# EAGLE design COBreplacement (EAGLE 9.2.2)
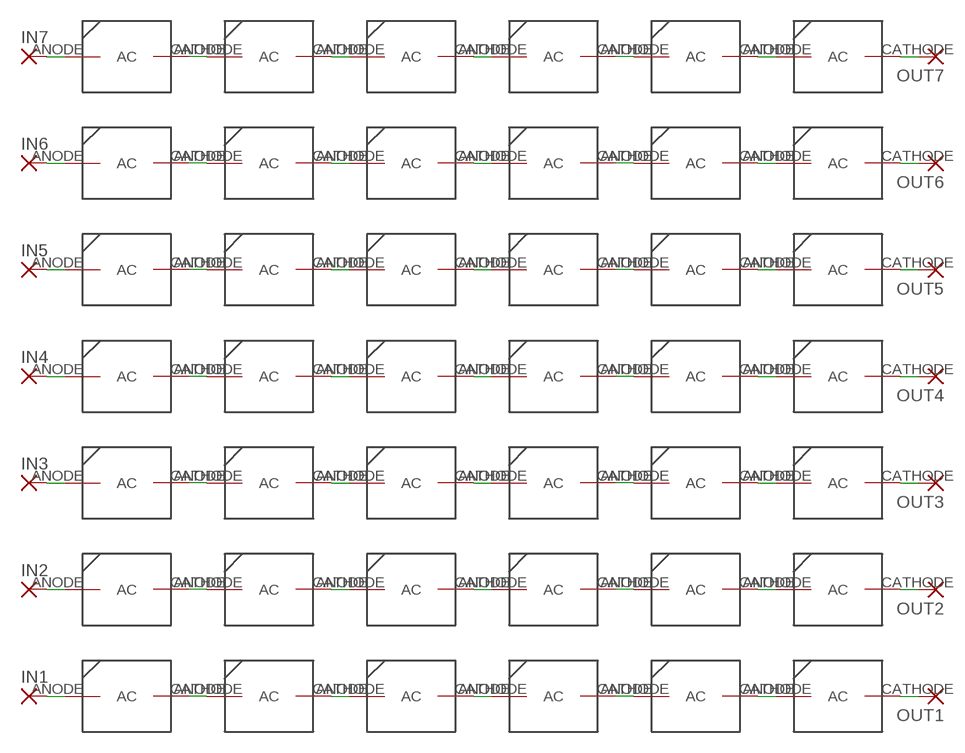
[diagram p0: schematic, sheet 1]

## Parts
IN1  SMD2  [SMD1,27-2,54]
IN2  SMD2  [SMD1,27-2,54]
IN3  SMD2  [SMD1,27-2,54]
IN4  SMD2  [SMD1,27-2,54]
IN5  SMD2  [SMD1,27-2,54]
IN6  SMD2  [SMD1,27-2,54]
IN7  SMD2  [SMD1,27-2,54]
OUT1  SMD2  [SMD1,27-2,54]
OUT2  SMD2  [SMD1,27-2,54]
OUT3  SMD2  [SMD1,27-2,54]
OUT4  SMD2  [SMD1,27-2,54]
OUT5  SMD2  [SMD1,27-2,54]
OUT6  SMD2  [SMD1,27-2,54]
OUT7  SMD2  [SMD1,27-2,54]
U$1  XPE35LED  [XPE35]
U$2  XPE35LED  [XPE35]
U$3  XPE35LED  [XPE35]
U$4  XPE35LED  [XPE35]
U$5  XPE35LED  [XPE35]
U$6  XPE35LED  [XPE35]
U$7  XPE35LED  [XPE35]
U$8  XPE35LED  [XPE35]
U$9  XPE35LED  [XPE35]
U$10  XPE35LED  [XPE35]
U$11  XPE35LED  [XPE35]
U$12  XPE35LED  [XPE35]
U$13  XPE35LED  [XPE35]
U$14  XPE35LED  [XPE35]
U$15  XPE35LED  [XPE35]
U$16  XPE35LED  [XPE35]
U$17  XPE35LED  [XPE35]
U$18  XPE35LED  [XPE35]
U$19  XPE35LED  [XPE35]
U$20  XPE35LED  [XPE35]
U$21  XPE35LED  [XPE35]
U$22  XPE35LED  [XPE35]
U$23  XPE35LED  [XPE35]
U$24  XPE35LED  [XPE35]
U$25  XPE35LED  [XPE35]
U$26  XPE35LED  [XPE35]
U$27  XPE35LED  [XPE35]
U$28  XPE35LED  [XPE35]
U$29  XPE35LED  [XPE35]
U$30  XPE35LED  [XPE35]
U$31  XPE35LED  [XPE35]
U$32  XPE35LED  [XPE35]
U$33  XPE35LED  [XPE35]
U$34  XPE35LED  [XPE35]
U$35  XPE35LED  [XPE35]
U$36  XPE35LED  [XPE35]
U$37  XPE35LED  [XPE35]
U$38  XPE35LED  [XPE35]
U$39  XPE35LED  [XPE35]
U$40  XPE35LED  [XPE35]
U$41  XPE35LED  [XPE35]
U$42  XPE35LED  [XPE35]

## Nets
N$1: U$1.CATHODE(C) U$2.ANODE(A)
N$2: U$2.CATHODE(C) U$3.ANODE(A)
N$3: U$3.CATHODE(C) U$4.ANODE(A)
N$4: U$4.CATHODE(C) U$5.ANODE(A)
N$5: U$5.CATHODE(C) U$6.ANODE(A)
N$6: IN6.1(P) U$1.ANODE(A)
N$7: OUT6.1(P) U$6.CATHODE(C)
N$8: U$7.CATHODE(C) U$8.ANODE(A)
N$9: U$8.CATHODE(C) U$9.ANODE(A)
N$10: U$9.CATHODE(C) U$10.ANODE(A)
N$11: U$10.CATHODE(C) U$11.ANODE(A)
N$12: U$11.CATHODE(C) U$12.ANODE(A)
N$13: IN5.1(P) U$7.ANODE(A)
N$14: OUT5.1(P) U$12.CATHODE(C)
N$15: U$13.CATHODE(C) U$14.ANODE(A)
N$16: U$14.CATHODE(C) U$15.ANODE(A)
N$17: U$15.CATHODE(C) U$16.ANODE(A)
N$18: U$16.CATHODE(C) U$17.ANODE(A)
N$19: U$17.CATHODE(C) U$18.ANODE(A)
N$20: IN4.1(P) U$13.ANODE(A)
N$21: OUT4.1(P) U$18.CATHODE(C)
N$22: U$19.CATHODE(C) U$20.ANODE(A)
N$23: U$20.CATHODE(C) U$21.ANODE(A)
N$24: U$21.CATHODE(C) U$22.ANODE(A)
N$25: U$22.CATHODE(C) U$23.ANODE(A)
N$26: U$23.CATHODE(C) U$24.ANODE(A)
N$27: IN3.1(P) U$19.ANODE(A)
N$28: OUT3.1(P) U$24.CATHODE(C)
N$29: U$25.CATHODE(C) U$26.ANODE(A)
N$30: U$26.CATHODE(C) U$27.ANODE(A)
N$31: U$27.CATHODE(C) U$28.ANODE(A)
N$32: U$28.CATHODE(C) U$29.ANODE(A)
N$33: U$29.CATHODE(C) U$30.ANODE(A)
N$34: IN2.1(P) U$25.ANODE(A)
N$35: OUT2.1(P) U$30.CATHODE(C)
N$36: U$31.CATHODE(C) U$32.ANODE(A)
N$37: U$32.CATHODE(C) U$33.ANODE(A)
N$38: U$33.CATHODE(C) U$34.ANODE(A)
N$39: U$34.CATHODE(C) U$35.ANODE(A)
N$40: U$35.CATHODE(C) U$36.ANODE(A)
N$41: IN1.1(P) U$31.ANODE(A)
N$42: OUT1.1(P) U$36.CATHODE(C)
N$43: U$37.CATHODE(C) U$38.ANODE(A)
N$44: U$38.CATHODE(C) U$39.ANODE(A)
N$45: U$39.CATHODE(C) U$40.ANODE(A)
N$46: U$40.CATHODE(C) U$41.ANODE(A)
N$47: U$41.CATHODE(C) U$42.ANODE(A)
N$48: IN7.1(P) U$37.ANODE(A)
N$49: OUT7.1(P) U$42.CATHODE(C)

## Library data of the parts
IN1-IN7 OUT1-OUT7 = wirepad:SMD2: SMD PAD
U$1-U$42 = XPE35LED:XPE35LED

## Board
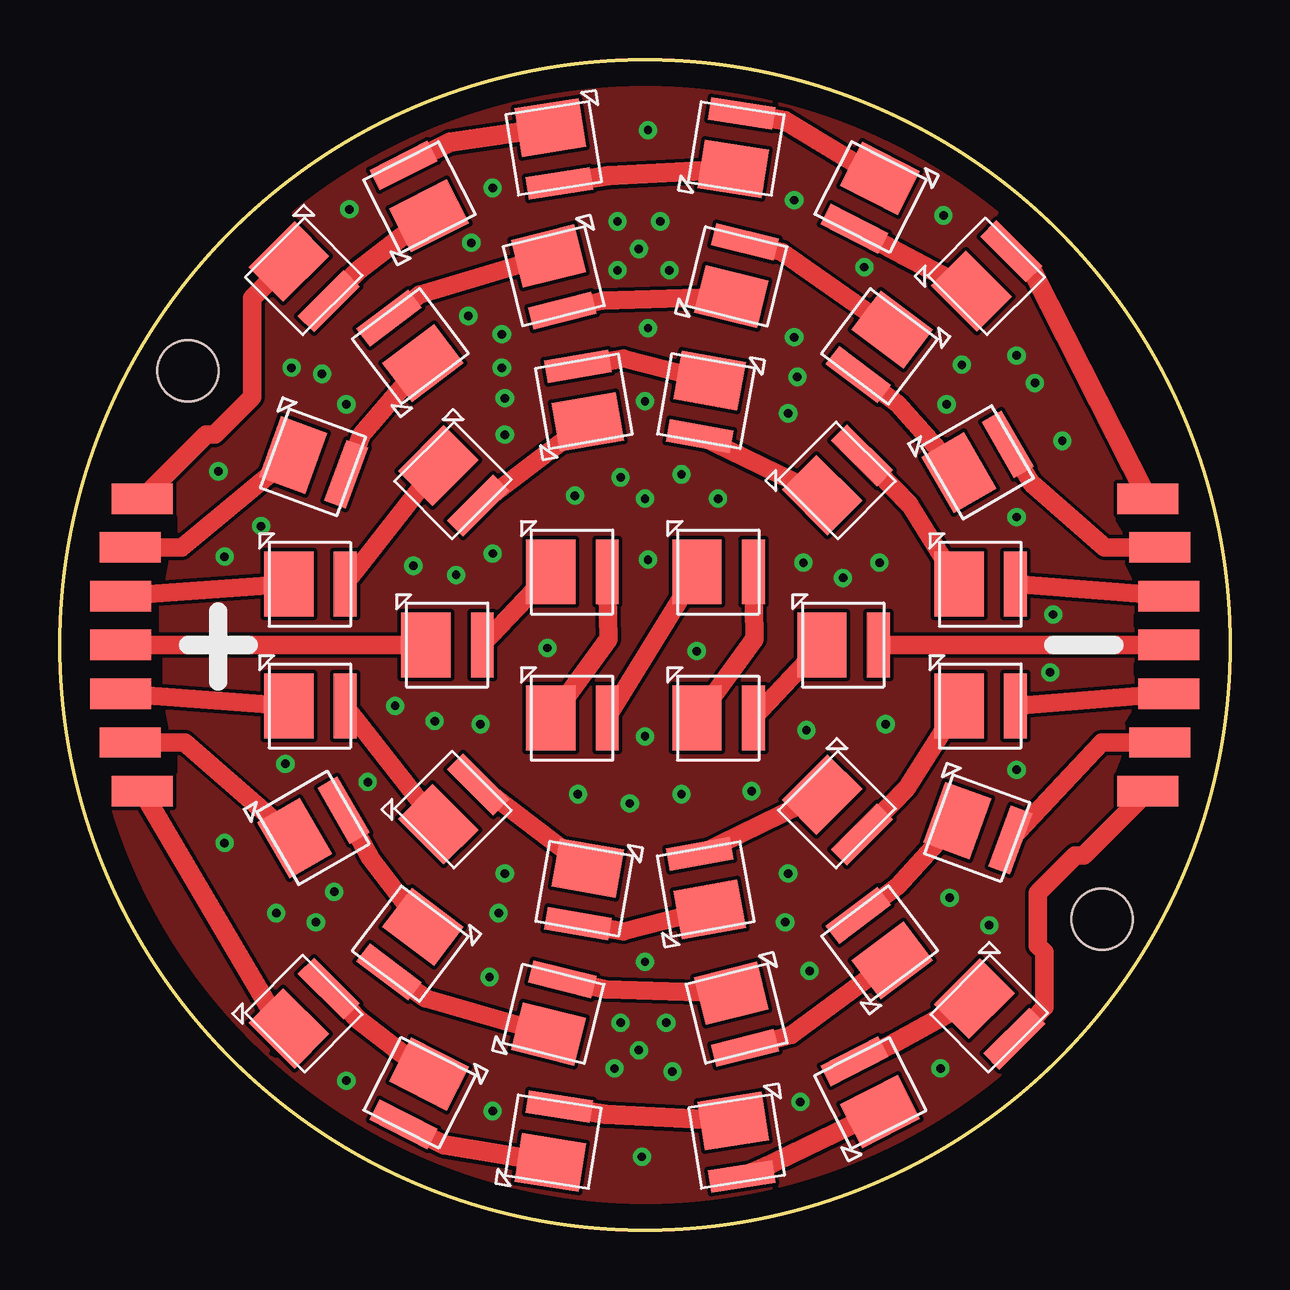
[diagram p1: board, top side]
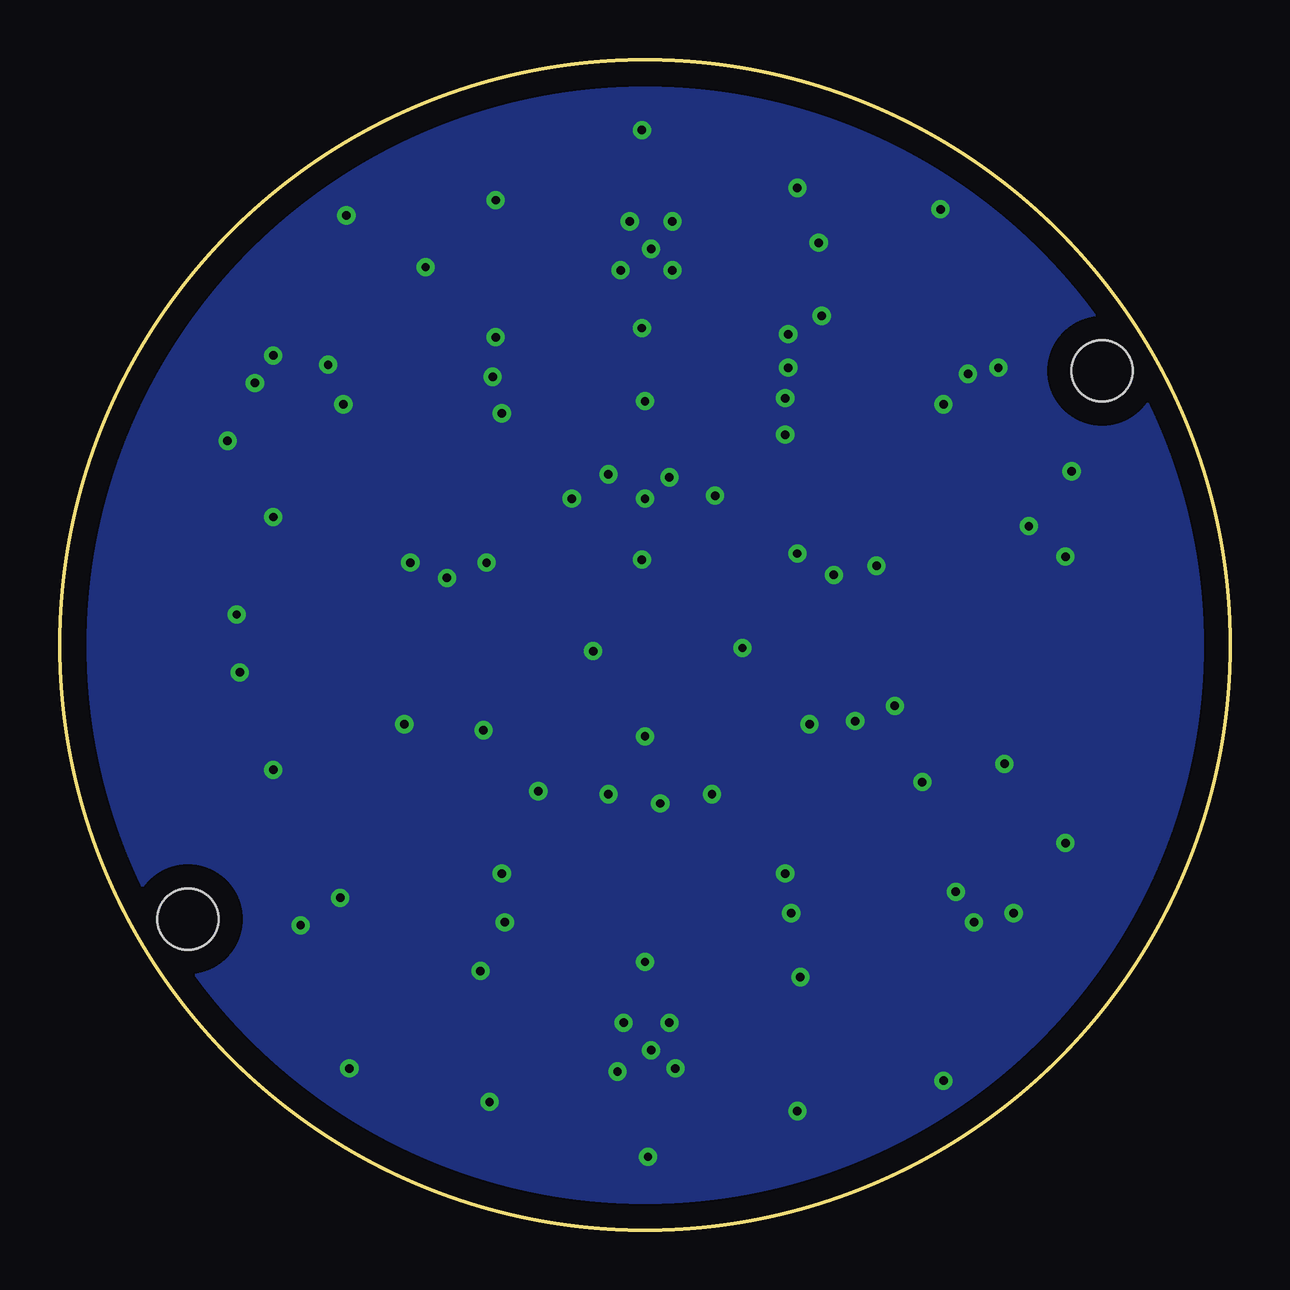
[diagram p2: board, bottom side, seen from below]

Size 48.77 x 48.77 mm. Coordinates in mm from the lower left corner, seen from the top.
Outline: circle at 24.38,24.38 radius 24.38
Copper layers (1*16): Top 0.035mm / dielectric 1.5mm / Bottom 0.035mm
Design rules "default *": minimum track width 6mil, minimum drill 0.35mm, track to track 6mil, track to pad 6mil, pad to pad 6mil, via to via 6mil, smd to smd 6mil, copper to edge 40mil, drill to drill 6mil, minimum pad ring 10mil, minimum via ring 8mil, stop-mask expansion 4mil, vias tented up to drill 14mil, thermal gap 10mil
Holes 2.54 mm at 5.33,35.81 43.43,12.95
tRestrict: 15 lines

### Footprints (pad centres in the part's own frame; a part is rotated, then mirrored left to right if it is on the bottom)
SMD1,27-2,54 = smd 1.27 x 2.54: 1 0,0
XPE35 = smd 2.05 x 2.7: ANODE -0.875,0 | smd 0.95 x 2.7: CATHODE 1.475,0

### Placement (x,y rotation side)
IN1  2.54,22.35 90 top
IN2  2.92,28.45 90 top
IN3  2.54,26.42 90 top
IN4  2.92,20.32 90 top
IN5  3.43,30.48 90 top
IN6  3.43,18.29 90 top
IN7  2.54,24.38 90 top
OUT1  46.23,22.35 90 top
OUT2  45.85,28.45 90 top
OUT3  46.23,26.42 90 top
OUT4  45.85,20.32 90 top
OUT5  45.34,30.48 90 top
OUT6  45.34,18.29 90 top
OUT7  46.23,24.38 90 top
U$1  10.16,9.02 45 top
U$2  14.99,5.71 243 top
U$3  20.57,3.68 81 top
U$4  28.19,3.68 279 top
U$5  33.78,5.71 117 top
U$6  38.73,9.02 315 top
U$7  10.16,39.75 315 top
U$8  14.99,43.05 117 top
U$9  20.57,45.09 279 top
U$10  28.19,45.09 81 top
U$11  33.78,43.05 243 top
U$12  38.61,39.75 45 top
U$13  10.54,16.76 30 top
U$14  14.61,11.94 233 top
U$15  20.57,9.02 76 top
U$16  28.19,9.02 284 top
U$17  34.16,11.94 127 top
U$18  38.23,16.76 340 top
U$19  10.41,26.92 0 top
U$20  16.38,31.24 315 top
U$21  21.84,34.54 100 top
U$22  26.92,34.54 260 top
U$23  32.38,31.24 45 top
U$24  38.35,26.92 0 top
U$25  10.54,32 340 top
U$26  14.61,36.83 127 top
U$27  20.57,39.75 284 top
U$28  28.19,39.75 76 top
U$29  34.16,36.83 233 top
U$30  38.23,32 30 top
U$31  10.41,21.84 0 top
U$32  16.38,17.53 45 top
U$33  21.84,14.22 260 top
U$34  26.92,14.22 100 top
U$35  32.38,17.53 315 top
U$36  38.35,21.84 0 top
U$37  16.13,24.38 0 top
U$38  21.34,27.43 0 top
U$39  21.34,21.34 0 top
U$40  27.43,27.43 0 top
U$41  27.43,21.34 0 top
U$42  32.64,24.38 0 top

### Tracks (layer width: path | path; a pad name or v marks a point on that pad's centre or on a via)
N$1
  Top 0.813: U$1.CATHODE 12.45,8.76 U$2.ANODE
N$2
  Top 0.813: U$2.CATHODE 16,3.56 U$3.ANODE
N$3
  Top 0.813: U$3.CATHODE 22.73,4.83 U$4.ANODE
N$4
  Top 0.813: U$4.CATHODE 29.21,2.54 U$5.ANODE
N$5
  Top 0.813: U$5.CATHODE 34.67,7.75 U$6.ANODE
N$6
  Top 0.813: U$1.ANODE 8.85,9.07 IN6.1
N$7
  Top 0.762: U$6.CATHODE 41.02,9.27 41.02,11.6 40.77,11.85 40.77,14.06 42.33,15.62 42.67,15.62 OUT6.1
N$8
  Top 0.813: U$7.CATHODE 12.45,40.01 U$8.ANODE
N$9
  Top 0.813: U$8.CATHODE 16.26,45.34 U$9.ANODE
N$10
  Top 0.813: U$9.CATHODE 22.86,43.94 U$10.ANODE
N$11
  Top 0.813: U$10.CATHODE 30.23,46.23 U$11.ANODE
N$12
  Top 0.813: U$11.CATHODE 34.92,40.77 U$12.ANODE
N$13
  Top 0.762: IN5.1 6.1,33.15 6.44,33.15 8,34.71 8,38.84 8.97,39.81
  Top 0.813: 8.97,39.81 U$7.ANODE
N$14
  Top 0.813: U$12.CATHODE 40.53,39.96 OUT5.1
N$15
  Top 0.762: U$13.CATHODE 12.95,15.49 U$14.ANODE
N$16
  Top 0.762: U$14.CATHODE 15.24,9.65 U$15.ANODE
N$17
  Top 0.762: U$15.CATHODE 22.73,10.03 U$16.ANODE
N$18
  Top 0.762: U$16.CATHODE 30.48,8.13 U$17.ANODE
N$19
  Top 0.762: U$17.CATHODE 34.92,14.35 U$18.ANODE
N$20
  Top 0.762: IN4.1 5.21,20.32 U$13.ANODE
N$21
  Top 0.762: OUT4.1 43.43,20.32 U$18.CATHODE
N$22
  Top 0.762: U$19.CATHODE U$20.ANODE
N$23
  Top 0.762: U$20.CATHODE U$21.ANODE
N$24
  Top 0.762: U$21.CATHODE 23.5,36.32 U$22.ANODE
N$25
  Top 0.762: U$22.CATHODE U$23.ANODE
N$26
  Top 0.762: U$23.CATHODE 35.43,30.23 U$24.ANODE
N$27
  Top 0.762: IN3.1 U$19.ANODE
N$28
  Top 0.762: OUT3.1 U$24.CATHODE
N$29
  Top 0.762: U$25.CATHODE 12.57,33.15 U$26.ANODE
N$30
  Top 0.762: U$26.CATHODE 14.99,38.99 U$27.ANODE
N$31
  Top 0.762: U$27.CATHODE 22.61,38.73 U$28.ANODE
N$32
  Top 0.762: U$28.CATHODE 30.1,40.77 U$29.ANODE
N$33
  Top 0.762: U$29.CATHODE 34.92,34.42 U$30.ANODE
N$34
  Top 0.762: IN2.1 5.08,28.45 U$25.ANODE
N$35
  Top 0.762: U$30.CATHODE 40.51,31.12 43.56,28.45 OUT2.1
N$36
  Top 0.762: U$32.ANODE U$31.CATHODE
N$37
  Top 0.762: U$32.CATHODE U$33.ANODE
N$38
  Top 0.762: U$33.CATHODE 23.5,12.45 U$34.ANODE
N$39
  Top 0.762: U$34.CATHODE U$35.ANODE
N$40
  Top 0.762: U$35.CATHODE 35.31,18.41 U$36.ANODE
N$41
  Top 0.762: U$31.ANODE IN1.1
N$42
  Top 0.762: OUT1.1 U$36.CATHODE
N$43
  Top 0.762: U$37.CATHODE U$38.ANODE
N$44
  Top 0.762: U$38.CATHODE 22.86,24.64 U$39.ANODE
N$45
  Top 0.762: U$39.CATHODE U$40.ANODE
N$46
  Top 0.762: U$40.CATHODE 28.96,24.64 U$41.ANODE
N$47
  Top 0.762: U$41.CATHODE U$42.ANODE
N$48
  Top 0.762: IN7.1 U$37.ANODE
N$49
  Top 0.762: OUT7.1 U$42.CATHODE
T1  (via drill 0.35)
  other vias: 18.03,28.19 17.53,21.08 13.97,21.84 14.73,27.69 21.46,30.61 24.38,30.48 24.51,27.94 27.43,30.48 34.16,27.81 34.42,21.08 31.12,20.83 25.91,18.16 24.38,20.57 21.59,18.16 18.54,14.86 17.91,10.54 24.38,11.18 30.35,14.86 31.24,10.79 37.08,13.84 38.73,12.7 39.88,19.18 39.88,29.72 41.78,32.89 40.64,35.31 37.59,36.07 30.61,37.21 30.35,34.04 24.51,37.59 24.13,40.89 25.02,42.04 18.03,43.43 18.41,37.34 18.54,34.67 10.92,35.69 8.38,29.34 9.4,19.43 12.83,18.67 30.61,42.93 36.83,42.29 18.29,13.21 9.02,13.21 6.86,16.13 11.94,6.22 18.03,4.95 24.13,7.49 24.26,3.05 30.86,5.33 30.23,12.83 36.7,6.73 30.99,27.81 26.54,24.13 20.32,24.26 24.38,34.54 18.41,35.94 30.73,35.56 6.6,31.62 12.06,42.55 24.51,45.85 6.86,28.07 11.94,34.42 9.65,35.94 18.54,33.15 16.51,27.3 15.62,21.21 23.75,17.78 28.83,18.29 23.37,31.37 25.91,31.5 25.4,40.01 23.24,40.01 23.24,42.04 17.14,41.15 17.02,38.1 33.53,40.13 36.96,34.42 32.64,27.18 39.88,36.45 41.4,25.65 41.27,23.24 23.37,8.64 25.27,8.64 25.53,6.6 23.11,6.73 11.43,14.1 10.67,12.83
  pour Top: -0.38,24.38 1.78,14.22 5.97,7.62 13.08,2.41 22.35,-0.76 33.53,0.89 43.18,7.75 48.39,17.78 48.93,23.86 45.47,38.73 33.05,47.27 25.91,49.53 14.48,47.62 5.59,41.02 0.64,31.62
  pour Bottom: -0.13,24 0.64,16.89 4.19,10.03 10.41,3.68 17.4,0.64 25.02,-0.38 34.92,1.27 42.8,7.62 46.99,14.48 49.02,20.83 48.77,29.08 47.24,34.29 44.58,38.86 40.01,43.81 34.42,46.99 27.3,48.89 20.07,48.64 13.97,46.74 9.4,43.56 5.59,40.13 2.03,34.42 -0.13,27.81